# Altium schematic sheet FPGA_POWER.SchDoc
size A4
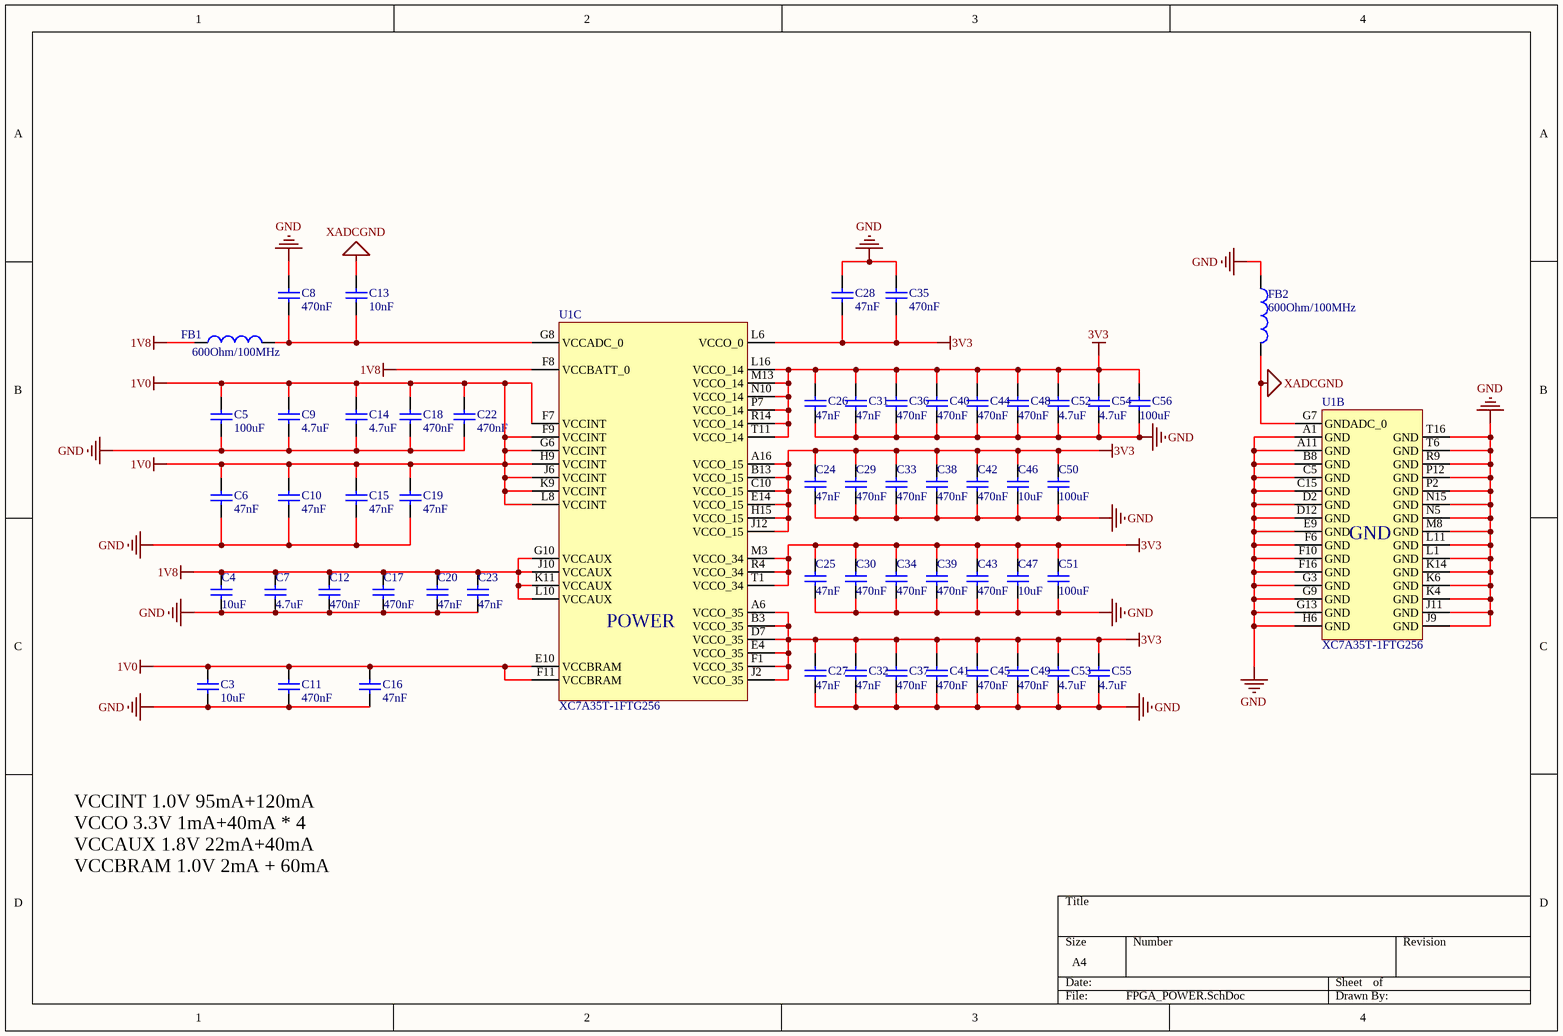
[diagram p0: FPGA_POWER.SchDoc]

## Parts
C3  value 10uF  [0402]  (hidden comment: Cap)
C4  value 10uF  [0402]  (hidden comment: Cap)
C5  value 100uF  [2512]  (hidden comment: Cap)
C6  value 47nF  [0402]  (hidden comment: Cap)
C7  value 4.7uF  [0402]  (hidden comment: Cap)
C8  value 470nF  [0402]  (hidden comment: Cap)
C9  value 4.7uF  [0402]  (hidden comment: Cap)
C10  value 47nF  [0402]  (hidden comment: Cap)
C11  value 470nF  [0402]  (hidden comment: Cap)
C12  value 470nF  [0402]  (hidden comment: Cap)
C13  value 10nF  [0402]  (hidden comment: Cap)
C14  value 4.7uF  [0402]  (hidden comment: Cap)
C15  value 47nF  [0402]  (hidden comment: Cap)
C16  value 47nF  [0402]  (hidden comment: Cap)
C17  value 470nF  [0402]  (hidden comment: Cap)
C18  value 470nF  [0402]  (hidden comment: Cap)
C19  value 47nF  [0402]  (hidden comment: Cap)
C20  value 47nF  [0402]  (hidden comment: Cap)
C22  value 470nF  [0402]  (hidden comment: Cap)
C23  value 47nF  [0402]  (hidden comment: Cap)
C24  value 47nF  [0402]  (hidden comment: Cap)
C25  value 47nF  [0402]  (hidden comment: Cap)
C26  value 47nF  [0402]  (hidden comment: Cap)
C27  value 47nF  [0402]  (hidden comment: Cap)
C28  value 47nF  [0402]  (hidden comment: Cap)
C29  value 470nF  [0402]  (hidden comment: Cap)
C30  value 470nF  [0402]  (hidden comment: Cap)
C31  value 47nF  [0402]  (hidden comment: Cap)
C32  value 47nF  [0402]  (hidden comment: Cap)
C33  value 470nF  [0402]  (hidden comment: Cap)
C34  value 470nF  [0402]  (hidden comment: Cap)
C35  value 470nF  [0402]  (hidden comment: Cap)
C36  value 470nF  [0402]  (hidden comment: Cap)
C37  value 470nF  [0402]  (hidden comment: Cap)
C38  value 470nF  [0402]  (hidden comment: Cap)
C39  value 470nF  [0402]  (hidden comment: Cap)
C40  value 470nF  [0402]  (hidden comment: Cap)
C41  value 470nF  [0402]  (hidden comment: Cap)
C42  value 470nF  [0402]  (hidden comment: Cap)
C43  value 470nF  [0402]  (hidden comment: Cap)
C44  value 470nF  [0402]  (hidden comment: Cap)
C45  value 470nF  [0402]  (hidden comment: Cap)
C46  value 10uF  [0402]  (hidden comment: Cap)
C47  value 10uF  [0402]  (hidden comment: Cap)
C48  value 470nF  [0402]  (hidden comment: Cap)
C49  value 470nF  [0402]  (hidden comment: Cap)
C50  value 100uF  [2512]  (hidden comment: Cap)
C51  value 100uF  [2512]  (hidden comment: Cap)
C52  value 4.7uF  [0402]  (hidden comment: Cap)
C53  value 4.7uF  [0402]  (hidden comment: Cap)
C54  value 4.7uF  [0402]  (hidden comment: Cap)
C55  value 4.7uF  [0402]  (hidden comment: Cap)
C56  value 100uF  [2512]  (hidden comment: Cap)
FB1  value 600Ohm/100MHz  [0402]  (hidden comment: Inductor)
FB2  value 600Ohm/100MHz  [0402]  (hidden comment: Inductor)
U1  XC7A35T-1FTG256  [BGA100P9X9-81A]  (parts B,C of 7)

## Nets
1V0: C3.1 C5.1 C6.1 C9.1 C10.1 C11.1 C14.1 C15.1 C16.1 C18.1 C19.1 C22.1 U1.E10(VCCBRAM) U1.F7(VCCINT) U1.F9(VCCINT) U1.F11(VCCBRAM) U1.G6(VCCINT) U1.H9(VCCINT) U1.J6(VCCINT) U1.K9(VCCINT) U1.L8(VCCINT)
1V8: C4.1 C7.1 C12.1 C17.1 C20.1 C23.1 FB1.1 U1.F8(VCCBATT_0) U1.G10(VCCAUX) U1.J10(VCCAUX) U1.K11(VCCAUX) U1.L10(VCCAUX)
3V3: C24.1 C25.1 C26.1 C27.1 C28.2 C29.1 C30.1 C31.1 C32.1 C33.1 C34.1 C35.2 C36.1 C37.1 C38.1 C39.1 C40.1 C41.1 C42.1 C43.1 C44.1 C45.1 C46.1 C47.1 C48.1 C49.1 C50.1 C51.1 C52.1 C53.1 C54.1 C55.1 C56.1 U1.A6(VCCO_35) U1.A16(VCCO_15) U1.B3(VCCO_35) U1.B13(VCCO_15) U1.C10(VCCO_15) U1.D7(VCCO_35) U1.E4(VCCO_35) U1.E14(VCCO_15) U1.F1(VCCO_35) U1.H15(VCCO_15) U1.J2(VCCO_35) U1.J12(VCCO_15) U1.L6(VCCO_0) U1.L16(VCCO_14) U1.M3(VCCO_34) U1.M13(VCCO_14) U1.N10(VCCO_14) U1.P7(VCCO_14) U1.R4(VCCO_34) U1.R14(VCCO_14) U1.T1(VCCO_34) U1.T11(VCCO_14)
GND: C3.2 C4.2 C5.2 C6.2 C7.2 C8.1 C9.2 C10.2 C11.2 C12.2 C14.2 C15.2 C16.2 C17.2 C18.2 C19.2 C20.2 C22.2 C23.2 C24.2 C25.2 C26.2 C27.2 C28.1 C29.2 C30.2 C31.2 C32.2 C33.2 C34.2 C35.1 C36.2 C37.2 C38.2 C39.2 C40.2 C41.2 C42.2 C43.2 C44.2 C45.2 C46.2 C47.2 C48.2 C49.2 C50.2 C51.2 C52.2 C53.2 C54.2 C55.2 C56.2 FB2.1 U1.A1(GND) U1.A11(GND) U1.B8(GND) U1.C5(GND) U1.C15(GND) U1.D2(GND) U1.D12(GND) U1.E9(GND) U1.F6(GND) U1.F10(GND) U1.F16(GND) U1.G3(GND) U1.G9(GND) U1.G13(GND) U1.H6(GND) U1.J9(GND) U1.J11(GND) U1.K4(GND) U1.K6(GND) U1.K14(GND) U1.L1(GND) U1.L11(GND) U1.M8(GND) U1.N5(GND) U1.N15(GND) U1.P2(GND) U1.P12(GND) U1.R9(GND) U1.T6(GND) U1.T16(GND)
XADCGND: C13.2 FB2.2 U1.G7(GNDADC_0)
NetC8_2: C8.2 C13.1 FB1.2 U1.G8(VCCADC_0)

## Notes on the sheet
- VCCINT 1.0V 95mA+120mA
  VCCO 3.3V 1mA+40mA * 4
  VCCAUX 1.8V 22mA+40mA
  VCCBRAM 1.0V 2mA + 60mA
- (in symbol XC7A35T-1FTG256, part C) POWER

## Library data of the parts
C3-C20 C22-C56 = Cap: 贴片电容; Published: 8-Jun-2000; LatestRevisionDate: 17-Jul-2002; LatestRevisionNote: Re-released for DXP Platform.; PackageReference: RAD-0.3; Publisher: Altium Limited
FB1 FB2 = Inductor: Code_IEC: 1005; Published: 8-Jun-2000; LatestRevisionDate: 29-May-2009; LatestRevisionNote: IPC-7351 Footprint Added.; PackageReference: 0402-A; Publisher: Altium Limited; PackageDescription: Chip Inductor; Code_JEITA: 0402